# Altium schematic sheet PhaseBLeg.SchDoc: Phase B
size A4; DrawnBy: Jarod Krane; Organization: Altium Limited; Address1: L3, 12a Rodborough Rd; Address2: Frenchs Forest; Address3: NSW; Address4: Australia 2086; Revision: 0; SheetNumber: 4; SheetTotal: 11
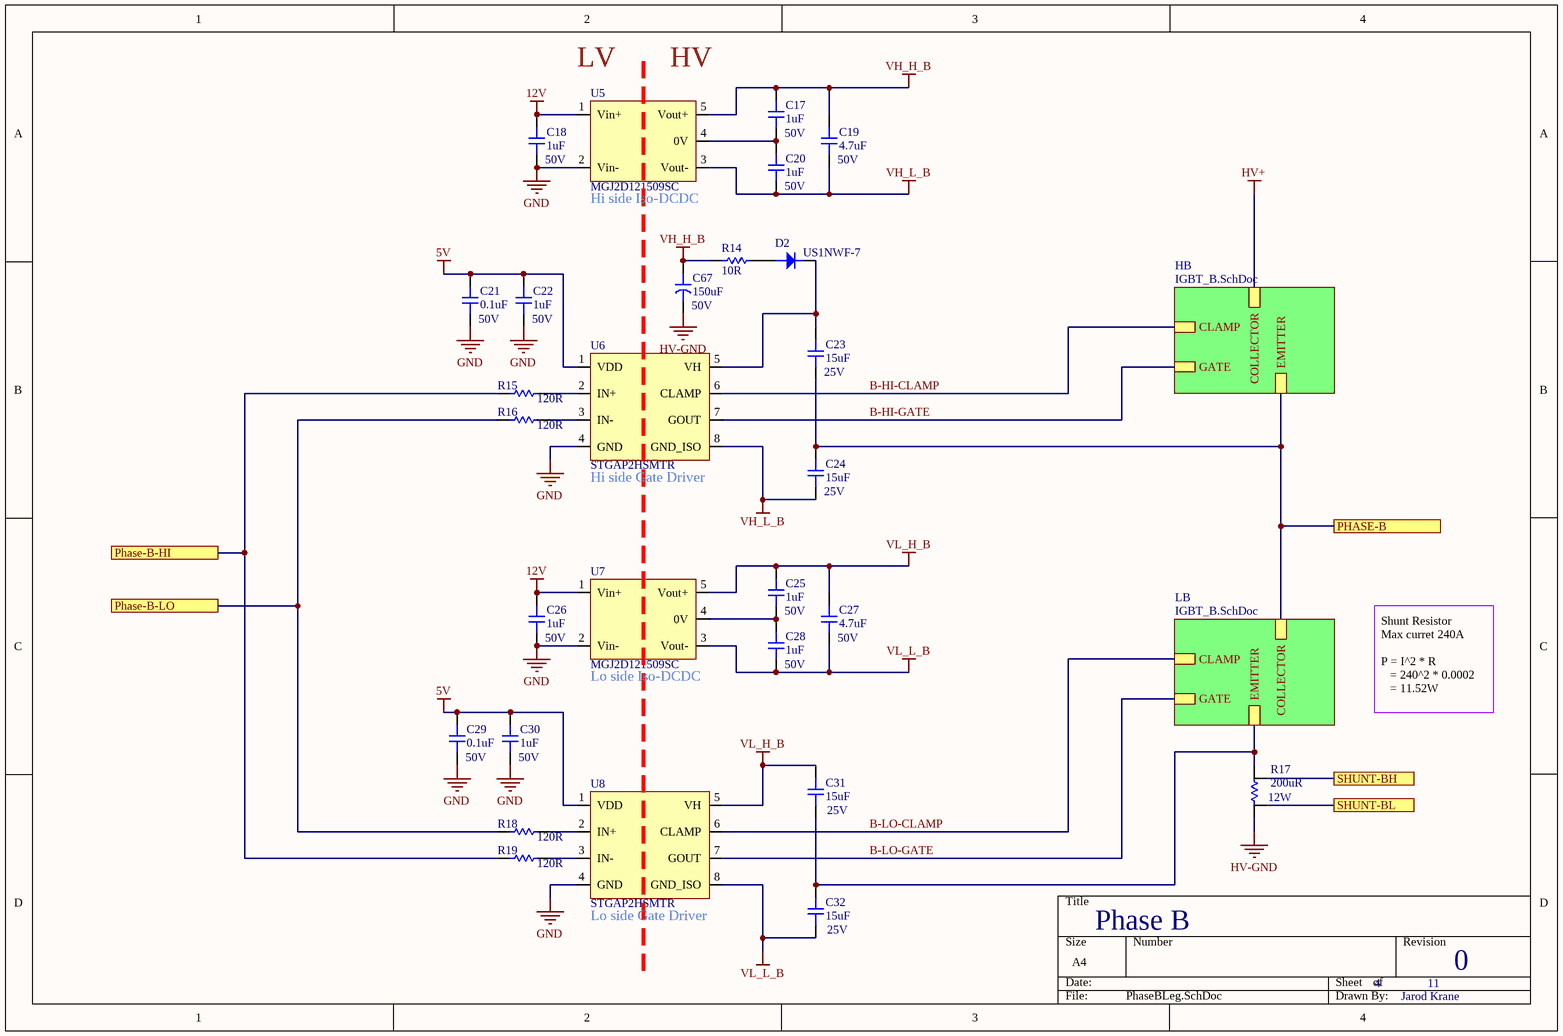
[diagram p0: PhaseBLeg.SchDoc]

## Parts
C17  1uF  Voltage Rating: 50V  [CAP-0805]
C18  1uF  Voltage Rating: 50V  [CAP-0805]
C19  4.7uF  Voltage Rating: 50V  [CAP-1206]
C20  1uF  Voltage Rating: 50V  [CAP-0805]
C21  0.1uF  Voltage: 50V  [CAP-0805]
C22  1uF  Voltage Rating: 50V  [CAP-0805]
C23  15uF  Voltage: 25V  [CAP-1812]
C24  15uF  Voltage: 25V  [CAP-1812]
C25  1uF  Voltage Rating: 50V  [CAP-0805]
C26  1uF  Voltage Rating: 50V  [CAP-0805]
C27  4.7uF  Voltage Rating: 50V  [CAP-1206]
C28  1uF  Voltage Rating: 50V  [CAP-0805]
C29  0.1uF  Voltage: 50V  [CAP-0805]
C30  1uF  Voltage Rating: 50V  [CAP-0805]
C31  15uF  Voltage: 25V  [CAP-1812]
C32  15uF  Voltage: 25V  [CAP-1812]
C67  150uF  Voltage: 50V  [CAPCAN-10mm]
D2  US1NWF-7  [DIOM2718X12N]
R14  10R  [RES-0603]
R15  120R  [RES-0603]
R16  120R  [RES-0603]
R17  200uR  Power: 12W  [RES-SHUNT]
R18  120R  [RES-0603]
R19  120R  [RES-0603]
U5  MGJ2D121509SC  [MGJ2]
U6  STGAP2HSMTR  [SO-8W]
U7  MGJ2D121509SC  [MGJ2]
U8  STGAP2HSMTR  [SO-8W]

## Sub-sheets
HB = IGBT_B.SchDoc: COLLECTOR, EMITTER, GATE, CLAMP
LB = IGBT_B.SchDoc: COLLECTOR, EMITTER, GATE, CLAMP

## Ports
PHASE-B, Phase-B-HI, Phase-B-LO, SHUNT-BH, SHUNT-BL

## Nets
5V: C21.2 C22.2 C29.2 C30.2 U6.1(VDD) U8.1(VDD)
12V: C18.2 C26.2 U5.1(Vin+) U7.1(Vin+)
GND: C18.1 C21.1 C22.1 C26.1 C29.1 C30.1 U5.2(Vin-) U6.4(GND) U7.2(Vin-) U8.4(GND)
HV+: sheet HB/COLLECTOR
HV-GND: C67.2 R17.1
VH_H_B: C17.2 C19.2 C67.1 R14.1 U5.5(Vout+)
VH_L_B: C19.1 C20.1 C24.1 U5.3(Vout-) U6.8(GND_ISO)
VL_H_B: C25.2 C27.2 C31.2 U7.5(Vout+) U8.5(VH)
VL_L_B: C27.1 C28.1 C32.1 U7.3(Vout-) U8.8(GND_ISO)
B-HI-CLAMP: U6.6(CLAMP) ; sheet HB/CLAMP
B-HI-GATE: U6.7(GOUT) ; sheet HB/GATE
B-LO-CLAMP: U8.6(CLAMP) ; sheet LB/CLAMP
B-LO-GATE: U8.7(GOUT) ; sheet LB/GATE
PHASE-B: C23.1 C24.2 ; port PHASE-B, sheet HB/EMITTER, sheet LB/COLLECTOR
Phase-B-HI: R15.1 R19.1 ; port Phase-B-HI
Phase-B-LO: R16.1 R18.1 ; port Phase-B-LO
SHUNT-BH: R17.4 ; port SHUNT-BH
SHUNT-BL: R17.3 ; port SHUNT-BL
NetC17_1: C17.1 C20.2 U5.4(0V)
NetC23_2: C23.2 D2.1 U6.5(VH)
NetC25_1: C25.1 C28.2 U7.4(0V)
NetC31_1: C31.1 C32.2 R17.2 ; sheet LB/EMITTER
NetD2_2: D2.2 R14.2
NetR15_2: R15.2 U6.2(IN+)
NetR16_2: R16.2 U6.3(IN-)
NetR18_2: R18.2 U8.2(IN+)
NetR19_2: R19.2 U8.3(IN-)

## Notes on the sheet
- (near U5) LV
- (near U5) HV
- (near U5) Hi side Iso-DCDC
- (near U6) Hi side Gate Driver
- (near U7) Lo side Iso-DCDC
- Shunt Resistor
  Max curret 240A
  P = I^2 * R
  = 240^2 * 0.0002
  = 11.52W
- (near U8) Lo side Gate Driver
- Title
- Size:
- Date:
- A4
- Number:
- Time:
- Revision:
- Sheet
- of
- File:

## Library data of the parts
C17 C18 C20 C22 C25 C26 C28 C30 = 0805-1uF-50V: CAP CER 1UF 50V X5R 0805; Manufacturer: KEMET; Manufacturer Part Number: C0805C105K5PACTU; Dielectric Material: Ceramic; Tolerance: 10%; Supplier 1: Digi-Key; Stock 1: 7193; Pricing 1: 1=0.33, 10=0.23, 100=0.1378, 500=0.10334, 1000=0.08726 (USD); Mount: Surface Mount; Case/Package: 0805; Weight: 0.000194oz; Case Code (Metric): 2012; Case Code (Imperial): 0805; Min Operating Temperature: -55°C; Max Operating Temperature: 85°C; Dielectric: X5R; Packaging: Tape and Reel; Termination: SMD/SMT; Voltage Rating (DC): 50V; Package Quantity: 2500; Capacitance: 1uF; Length: 0.079inch; Width: 0.049inch; Thickness: 0.055inch; REACH SVHC: No SVHC; Lead Free: Lead Free; ComponentLink1URL: https://api.kemet.com/component-edge/download/datasheet/C0805C105K5PAC7800.pdf?src-supplier=Digi-Key; ComponentLink1Description: https://api.kemet.com/component-edge/download/datasheet/C0805C105K5PAC7800.pdf?src-supplier=Digi-Key; ComponentLink2URL: http://www.farnell.com/datasheets/2746140.pdf?src-supplier=Farnell; ComponentLink2Description: http://www.farnell.com/datasheets/2746140.pdf?src-supplier=Farnell; ComponentLink3URL: http://www.mouser.com/ds/2/212/KEM_C1006_X5R_SMD-1103249.pdf?src-supplier=Mouser; ComponentLink3Description: http://www.mouser.com/ds/2/212/KEM_C1006_X5R_SMD-1103249.pdf?src-supplier=Mouser; ComponentLink4URL: http://www.farnell.com/datasheets/2746140.pdf?src-supplier=Newark; ComponentLink4Description: http://www.farnell.com/datasheets/2746140.pdf?src-supplier=Newark; ComponentLink5URL: http://www.farnell.com/datasheets/2032728.pdf?src-supplier=Element14; ComponentLink5Description: http://www.farnell.com/datasheets/2032728.pdf?src-supplier=Element14; Supplier Part Number 1: 399-15436-6-ND
C19 C27 = 1206-4.7uF-50V: CAP CER 4.7UF 50V X7R 1206; Manufacturer: TDK; Manufacturer Part Number: C3216X7R1H475K160AC; Dielectric Material: Ceramic; Tolerance: 10%; Supplier 1: Digi-Key; Stock 1: 117540; Pricing 1: 1=0.76, 10=0.535, 50=0.4042, 100=0.3521, 500=0.26082, 1000=0.2217 (USD); Mount: Surface Mount; Case/Package: 1206; Case Code (Metric): 3216; Case Code (Imperial): 1206; Weight: 0.000571oz; Min Operating Temperature: -55°C; Max Operating Temperature: 125°C; Capacitance: 4.7uF; Packaging: Tape and Reel; Voltage Rating (DC): 50V; Termination: SMD/SMT; Series: C; Package Quantity: 1; Dielectric: X7R; Resistor Type: Ceramic; Length: 3.2mm; Width: 0.063inch; Depth: 1.6mm; Thickness: 1.6mm; REACH SVHC: No SVHC; Lead Free: Lead Free; RoHS Compliant: Yes; ComponentLink1URL: https://product.tdk.com/info/en/catalog/datasheets/mlcc_commercial_general_en.pdf?src-supplier=Digi-Key; ComponentLink1Description: https://product.tdk.com/info/en/catalog/datasheets/mlcc_commercial_general_en.pdf?src-supplier=Digi-Key; ComponentLink2URL: http://www.mouser.com/ds/2/400/lcc_commercial_general_en-560200.pdf?src-supplier=Mouser; ComponentLink2Description: http://www.mouser.com/ds/2/400/lcc_commercial_general_en-560200.pdf?src-supplier=Mouser; ComponentLink3URL: http://product.tdk.com/capacitor/mlcc/en/documents/mlcc_commercial_general_en.pdf?src-supplier=Future+Electronics; ComponentLink3Description: http://product.tdk.com/capacitor/mlcc/en/documents/mlcc_commercial_general_en.pdf?src-supplier=Future+Electronics; Supplier Part Number 1: 445-8032-6-ND
C21 C29 = 0805-0.1uF-50V: CAP CER 0.1UF 50V Y5V 0805; Manufacturer: KEMET; Manufacturer Part Number: C0805C104Z5VACTU; Dielectric Material: Ceramic; Capacitance: 100nF; Tolerance: 80%; Dissipation Factor: 5%; Supplier 1: Digi-Key; Stock 1: 929243; Pricing 1: 1=0.1, 10=0.057, 100=0.0254, 500=0.01818, 1000=0.01428 (USD); Mount: Surface Mount,PCB; Case/Package: 0805; Number of Pins: 2; Case Code (Metric): 2012; Case Code (Imperial): 0805; Min Operating Temperature: -30°C; Max Operating Temperature: 85°C; Package Quantity: 1; Voltage Rating: 50V; Packaging: Tape and Reel; Voltage Rating (DC): 50V; Dielectric: Y5V; Termination: SMD/SMT; Length: 2mm; Height: 0.9mm; Lead Pitch: 0.75mm; Width: 0.049inch; Thickness: 0.039inch; Depth: 1.25mm; Radiation Hardening: No; REACH SVHC: No SVHC; Lead Free: Lead Free; ComponentLink1URL: http://www.alliedelec.com/m/d/9bfe7773041ffe9d406e68bc7b377fdd.pdf?src-supplier=Allied+Electronics; ComponentLink1Description: http://www.alliedelec.com/m/d/9bfe7773041ffe9d406e68bc7b377fdd.pdf?src-supplier=Allied+Electronics; ComponentLink2URL: https://www.verical.com/server-webapp/html/getDatasheet?partID=37101&src-supplier=Verical; ComponentLink2Description: https://www.verical.com/server-webapp/html/getDatasheet?partID=37101&src-supplier=Verical; ComponentLink3URL: https://www.verical.com/server-webapp/html/getDatasheet?partID=321176&src-supplier=Verical; ComponentLink3Description: https://www.verical.com/server-webapp/html/getDatasheet?partID=321176&src-supplier=Verical; ComponentLink4URL: http://www.farnell.com/datasheets/2123124.pdf?src-supplier=Element14; ComponentLink4Description: http://www.farnell.com/datasheets/2123124.pdf?src-supplier=Element14; Supplier Part Number 1: 399-1177-6-ND
C23 C24 C31 C32 = 1812-15uF-25V: CAP CER 15UF 25V X7R 1812; Manufacturer: TDK; Manufacturer Part Number: C4532X7R1E156M280KB; Dielectric Material: Ceramic; Tolerance: 20%; Supplier 1: Digi-Key; Stock 1: 9166; Pricing 1: 1=1.18, 10=0.932, 50=0.8072, 100=0.6986 (USD); Mount: Surface Mount; Case/Package: 1812; Number of Pins: 2; Case Code (Imperial): 1812; Case Code (Metric): 4532; Weight: 0.000952oz; Min Operating Temperature: -55°C; Max Operating Temperature: 125°C; Voltage Rating: 25V; Capacitance: 15uF; Voltage Rating (DC): 25V; Packaging: Tape and Reel; Dielectric: X7R; Termination: SMD/SMT; Package Quantity: 1; Resistor Type: Ceramic; Series: C; Length: 4.5mm; Width: 0.126inch; Height: 2.8mm; Depth: 3.2mm; Thickness: 0.122inch; RoHS Compliant: Yes; Lead Free: Lead Free; REACH SVHC: No SVHC; ComponentLink1URL: http://www.farnell.com/datasheets/1913358.pdf?src-supplier=Element14; ComponentLink1Description: http://www.farnell.com/datasheets/1913358.pdf?src-supplier=Element14; ComponentLink2URL: https://product.tdk.com/info/en/documents/chara_sheet/C4532X7R1E156M280KB.pdf?src-supplier=Digi-Key; ComponentLink2Description: https://product.tdk.com/info/en/documents/chara_sheet/C4532X7R1E156M280KB.pdf?src-supplier=Digi-Key; ComponentLink3URL: https://product.tdk.com/en/products/common/pdf/mlcc_partnumber_description.pdf?src-supplier=Digi-Key; ComponentLink3Description: https://product.tdk.com/en/products/common/pdf/mlcc_partnumber_description.pdf?src-supplier=Digi-Key; ComponentLink4URL: http://uk.rs-online.com/webdocs/1532/0900766b81532cd0.pdf?src-supplier=RSComponents; ComponentLink4Description: http://uk.rs-online.com/webdocs/1532/0900766b81532cd0.pdf?src-supplier=RSComponents; ComponentLink5URL: http://www.tdk.com/pdf/general_B11.pdf?src-supplier=Future+Electronics; ComponentLink5Description: http://www.tdk.com/pdf/general_B11.pdf?src-supplier=Future+Electronics; Supplier Part Number 1: 445-3921-6-ND
C67 = 10mm-150uF-50V: CAP POLYMER HYBRID 150UF 50V SMD; Manufacturer: Panasonic; Manufacturer Part Number: EEHZS1H151P; Supplier 1: Digi-Key; Stock 1: 1212; Pricing 1: 1=2.07, 10=1.673, 50=1.46, 100=1.2775 (USD); Supplier Part Number 1: 10-EEH-ZS1H151PDKR-ND
D2 = Diode 1.2KV-1A: DIODE GEN PURP 1.2KV 1A SOD123F; Manufacturer: Diodes; Reverse Recovery Time: 80ns; Supplier 1: Digi-Key; Manufacturer Part Number: US1NWF-7; Stock 1: 33557; Pricing 1: 1=0.54, 10=0.438, 100=0.2985, 500=0.22388, 1000=0.1679 (USD); Mount: Surface Mount; Packaging: Tape and Reel; Max Reverse Voltage (DC): 1.2kV; Average Rectified Current: 1A; ComponentLink1URL: https://www.diodes.com/assets/Datasheets/US1NWF.pdf?src-supplier=Digi-Key; ComponentLink1Description: https://www.diodes.com/assets/Datasheets/US1NWF.pdf?src-supplier=Digi-Key; Supplier Part Number 1: US1NWF-7DIDKR-ND
R14 = 0603-10R: RES SMD 10 OHM 1% 1/10W 0603; Manufacturer: Yageo; Manufacturer Part Number: RC0603FR-0710RL; Voltage Rating (DC): 50V; Temperature Coefficient: 200ppm/°C; Power Rating: 100mW; Supplier 1: Digi-Key; Stock 1: 11151092; Pricing 1: 1=0.1, 10=0.046, 100=0.0187, 1000=0.0084, 2500=0.00729 (USD); Case/Package: 0603; Number of Pins: 2; Case Code (Imperial): 0603; Case Code (Metric): 1608; Contact Plating: Tin,Matte; Min Operating Temperature: -55°C; Max Operating Temperature: 155°C; Packaging: Tape and Reel; Resistance: 10R; Tolerance: 1%; Composition: Thick Film; Voltage Rating: 50V; Termination: SMD/SMT; Military Standard: Not; Length: 1.6mm; Height: 0.45mm; Width: 0.8mm; Depth: 0.8mm; Radiation Hardening: No; REACH SVHC: No SVHC; Lead Free: Lead Free; ComponentLink1URL: http://www.farnell.com/datasheets/1868787.pdf?src-supplier=Element14; ComponentLink1Description: http://www.farnell.com/datasheets/1868787.pdf?src-supplier=Element14; ComponentLink2URL: http://www.yageo.com/documents/recent/PYu-RC0603_51_RoHS_L_4.pdf?src-supplier=Avnet; ComponentLink2Description: http://www.yageo.com/documents/recent/PYu-RC0603_51_RoHS_L_4.pdf?src-supplier=Avnet; ComponentLink3URL: http://documents.rs-components.com/techlib://itc_doclist_GB.htm?stockno=5048984&src-supplier=RSComponents; ComponentLink3Description: http://documents.rs-components.com/techlib://itc_doclist_GB.htm?stockno=5048984&src-supplier=RSComponents; ComponentLink4URL: http://www.yageo.com/documents/recent/PYu-RC0603_51_RoHS_L_4.pdf?src-supplier=Avnet+Europe; ComponentLink4Description: http://www.yageo.com/documents/recent/PYu-RC0603_51_RoHS_L_4.pdf?src-supplier=Avnet+Europe; Supplier Part Number 1: 311-10.0HRDKR-ND
R15 R16 R18 R19 = 0603-120R: RES SMD 120 OHM 1% 1/10W 0603; Manufacturer: Yageo; Manufacturer Part Number: RC0603FR-07120RL; Voltage Rating (DC): 50V; Temperature Coefficient: 100ppm/°C; Power Rating: 100mW; Supplier 1: Digi-Key; Stock 1: 1047274; Pricing 1: 1=0.1, 10=0.023, 100=0.0094, 1000=0.00421, 2500=0.00366 (USD); Case/Package: 0603; Number of Pins: 2; Case Code (Metric): 1608; Case Code (Imperial): 0603; Min Operating Temperature: -55°C; Max Operating Temperature: 155°C; Resistance: 120R; Tolerance: 1%; Packaging: Tape and Reel; Composition: Thick Film; Voltage Rating: 50V; Package Quantity: 1; Number of Terminations: 2; Termination: SMD/SMT; Military Standard: Not; Max Power Dissipation: 100mW; Features: Moisture Resistant; Length: 1.6mm; Height: 0.022inch; Width: 0.031inch; Depth: 0.8mm; REACH SVHC: No SVHC; Lead Free: Lead Free; ComponentLink1URL: http://www.yageo.com/documents/recent/PYu-RC_Group_51_RoHS_L_10.pdf?src-supplier=Digi-Key; ComponentLink1Description: http://www.yageo.com/documents/recent/PYu-RC_Group_51_RoHS_L_10.pdf?src-supplier=Digi-Key; ComponentLink2URL: http://www.farnell.com/datasheets/2167052.pdf?src-supplier=Element14; ComponentLink2Description: http://www.farnell.com/datasheets/2167052.pdf?src-supplier=Element14; ComponentLink3URL: http://www.farnell.com/datasheets/1868787.pdf?src-supplier=Element14; ComponentLink3Description: http://www.farnell.com/datasheets/1868787.pdf?src-supplier=Element14; ComponentLink4URL: http://www.farnell.com/datasheets/443971.pdf?src-supplier=Element14; ComponentLink4Description: http://www.farnell.com/datasheets/443971.pdf?src-supplier=Element14; Supplier Part Number 1: 311-120HRDKR-ND
R17 = 3920-200uR-SHUNT: RES SMD 200 UOHM 1% 12W 3920; Manufacturer: Bourns; Manufacturer Part Number: CSS2H-3920R-L200FE; Supplier 1: Digi-Key; Stock 1: 420; Pricing 1: 1=1.6, 10=1.42, 25=1.3052, 50=1.1908, 100=1.0305, 250=0.8702, 500=0.7328 (USD); RoHS Compliant: Yes; ComponentLink1URL: https://www.bourns.com/docs/Product-Datasheets/css2h-3920.pdf?src-supplier=Digi-Key; ComponentLink1Description: https://www.bourns.com/docs/Product-Datasheets/css2h-3920.pdf?src-supplier=Digi-Key; Supplier Part Number 1: CSS2H-3920R-L200FEDKR-ND
U5 U7 = 15V/-8.7V: Isolated Module DC DC Converter Output 15V -8.7V - 80mA, 40mA 10.8V - 13.2V Input; Manufacturer: Murata; Number of Outputs: 2; Output Power: 2W; Isolation Voltage: 5.2kV; Efficiency: 80%; Nominal Input Voltage: 12V; Supplier 1: Digi-Key; Manufacturer Part Number: MGJ2D121509SC; Stock 1: 371; Pricing 1: 1=8.46, 5=8.42, 10=8.36, 25=8.27, 50=8.06, 100=7.66, 250=7.17, 500=6.68, 1000=6.65 (USD); Mount: Through Hole; Case/Package: SIP; Number of Pins: 5; Weight: 0.151678oz; Min Operating Temperature: -40°C; Max Operating Temperature: 100°C; Max Input Voltage: 13.2V; Min Input Voltage: 10.8V; Packaging: Rail/Tube; Max Input Voltage (DC): 13.2V; Min Input Voltage (DC): 10.8V; Voltage - Output 1: 15V; Voltage - Output 2: -8.7V; Max Output Current: 40mA; Current - Output 1: 80mA; Current - Output 2: 40mA; Max Output Power: 2W; Output Voltage: 15V; Output Current: 80mA; Max Power Dissipation: 2W; Package Quantity: 25; Features: SCP; Length: 0.77inch; Width: 0.39inch; Height: 0.5inch; Depth: 12.65mm; Radiation Hardening: No; REACH SVHC: No SVHC; RoHS Compliant: Yes; ComponentLink1URL: http://www.farnell.com/datasheets/1965123.pdf?src-supplier=Element14; ComponentLink1Description: http://www.farnell.com/datasheets/1965123.pdf?src-supplier=Element14; ComponentLink2URL: http://power.murata.com/data/power/ncl/kdc_mgj2.pdf?src-supplier=Avnet; ComponentLink2Description: http://power.murata.com/data/power/ncl/kdc_mgj2.pdf?src-supplier=Avnet; Supplier Part Number 1: 811-3002-5-ND
U6 U8 = STGAP2HSMTR: GALVANICALLY ISOLATED 4 A SINGLE GATE DRIVER; Manufacturer: Samtec; Manufacturer Part Number: ERF8-010-07.0-L-DV-L-K-TR; Supplier 1: Digi-Key; Stock 1: 498; Pricing 1: 1=3.01, 10=2.699, 25=2.5516, 100=2.2113, 250=2.09788, 500=1.88242 (USD); Supplier Part Number 1: 497-STGAP2HSMDKR-ND